# EAGLE design Controller V0.1 (EAGLE 9.5.1)
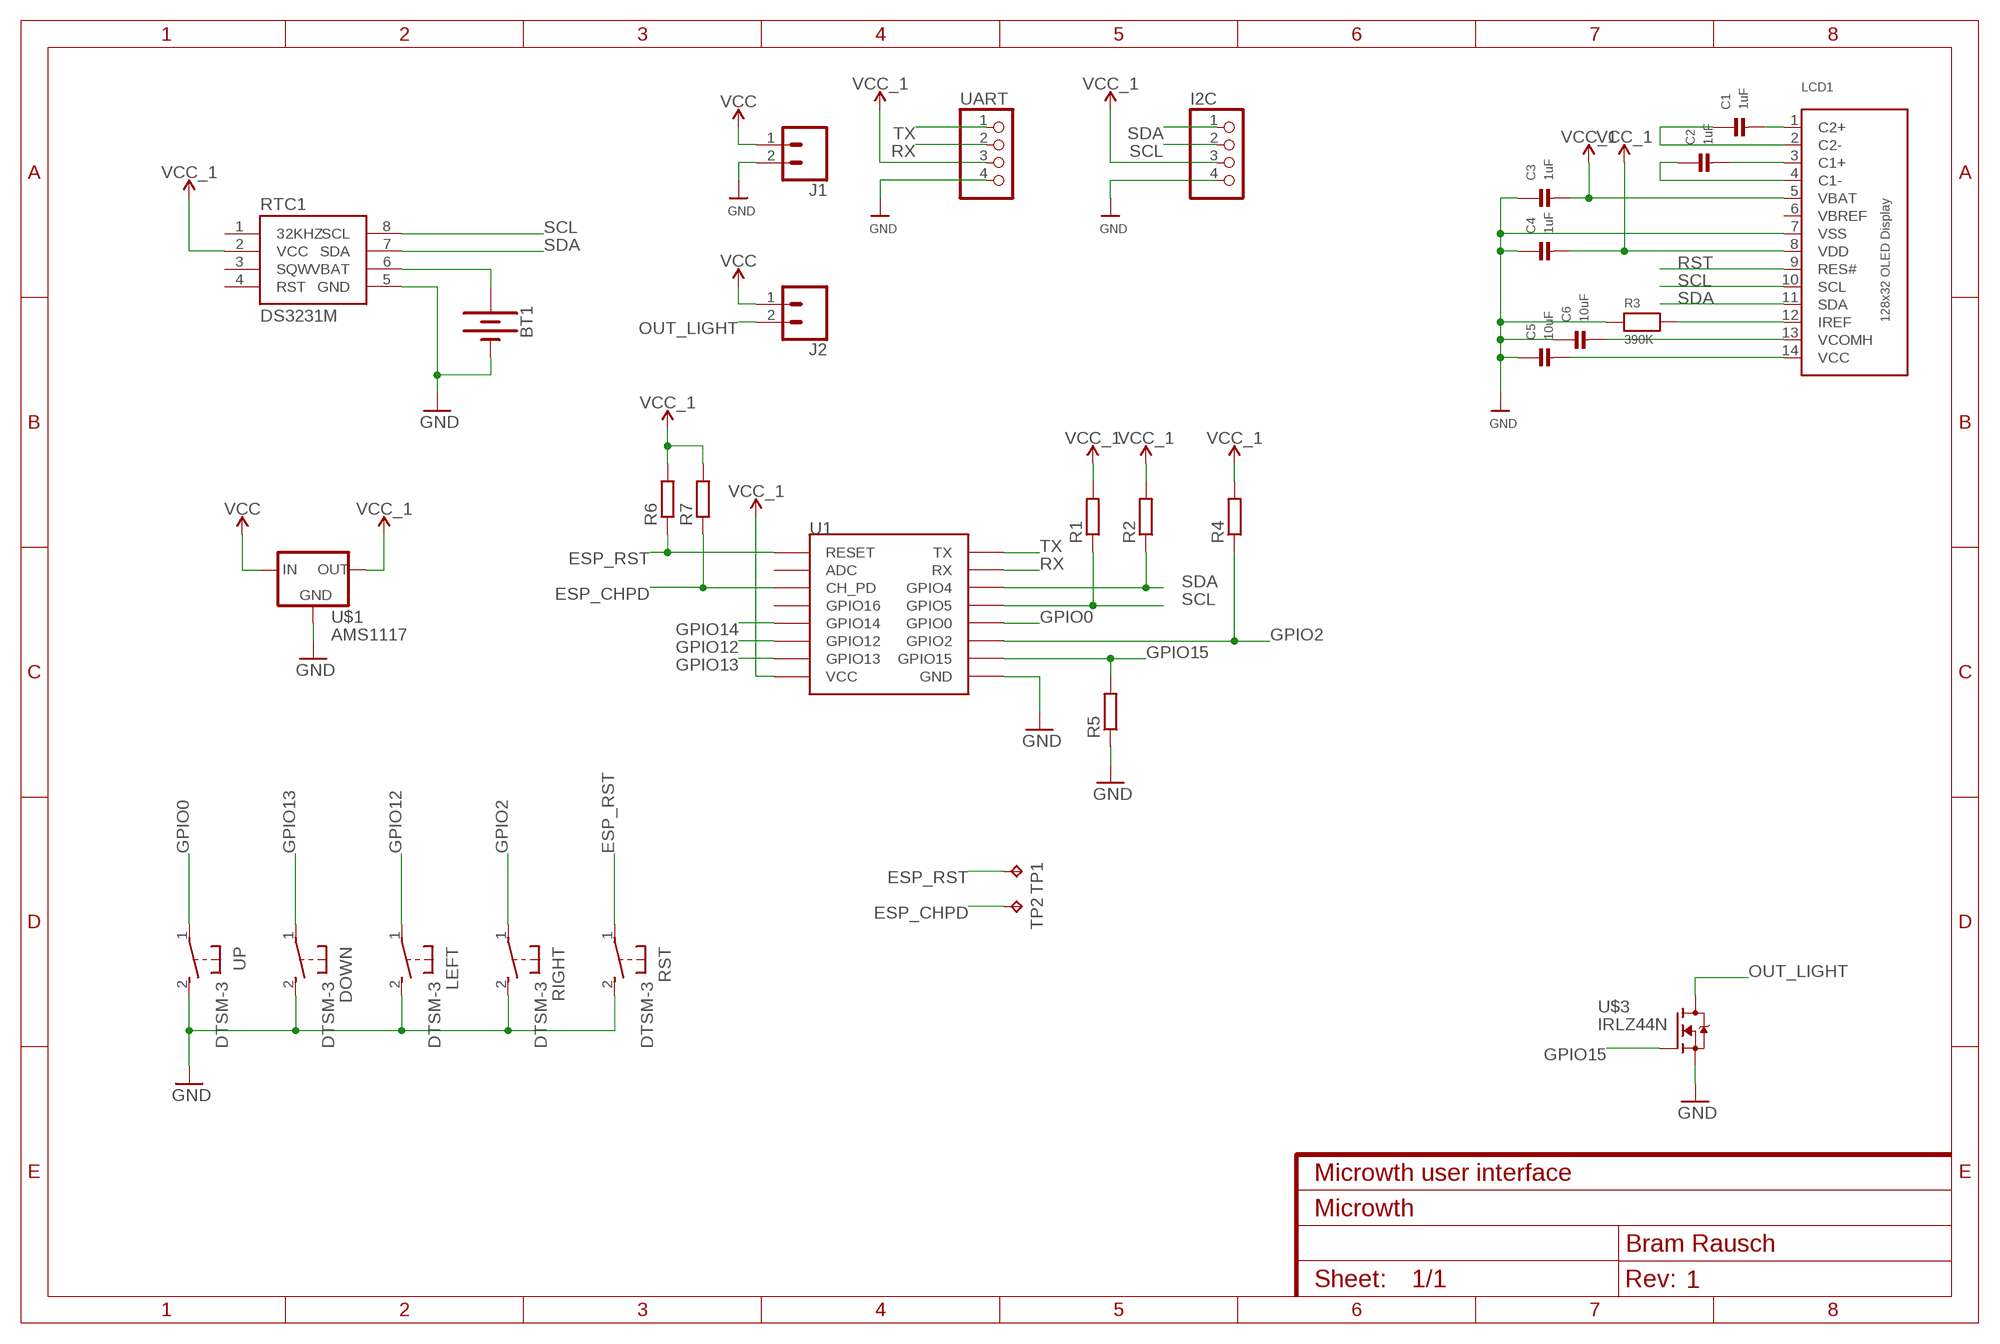
[diagram p0: schematic, sheet 1]
FRAME1 (FRAME-A4L): PROJECT: Microwth; TITLE: Microwth user interface

## Parts
BT1  BATTERY-20MM_PTH  [BATTCOM_20MM_PTH]
C1  1uF  CAP_CERAMIC0805  [0805]
C2  1uF  CAP_CERAMIC0805  [0805]
C3  1uF  CAP_CERAMIC0805  [0805]
C4  1uF  CAP_CERAMIC0805  [0805]
C5  10uF  CAP_CERAMIC0805  [0805]
C6  10uF  CAP_CERAMIC0805  [0805]
DOWN  DTSM-3  [DTSM-3]
I2C  PINHD-1X4  [1X04]
J1  CONN_02PTH4  [1X02_XTRA_BIG]
J2  CONN_02PTH4  [1X02_XTRA_BIG]
LCD1  DISP_OLED_UG-2832HSWEG02  [UG-2832HSWEG02_WRAPUNDER]
LEFT  DTSM-3  [DTSM-3]
R1  R-EU_R0805  [R0805]
R2  R-EU_R0805  [R0805]
R3  390K  RESISTOR0805  [0805]
R4  R-EU_R0805  [R0805]
R5  R-EU_R0805  [R0805]
R6  R-EU_R0805  [R0805]
R7  R-EU_R0805  [R0805]
RIGHT  DTSM-3  [DTSM-3]
RST  DTSM-3  [DTSM-3]
RTC1  DS3231M  [SO08]
TP1  TPB2,54  [B2,54]
TP2  TPB2,54  [B2,54]
U1  ESP12SMD  [ESP12-SMD]
U$1  AMS1117  [SOT223]
U$3  IRLZ44N  [TO220]
UART  PINHD-1X4  [1X04]
UP  DTSM-3  [DTSM-3]

## Nets
ESP_CHPD: R7.1 TP2.TP U1.CH_PD
ESP_RST: R6.1 RST.1 TP1.TP U1.RESET
GND: BT1.2(-) C3.1 C4.1 C5.1 C6.1 DOWN.2 I2C.4 J1.2 LCD1.7(VSS) LEFT.2 R3.1 R5.1 RIGHT.2 RST.2 RTC1.5(GND) U1.GND U$1.1(GND) U$3.3(S) UART.4 UP.2
GPIO0: U1.GPIO0 UP.1
GPIO2: R4.1 RIGHT.1 U1.GPIO2
GPIO12: LEFT.1 U1.GPIO12
GPIO13: DOWN.1 U1.GPIO13
GPIO14: U1.GPIO14
GPIO15: R5.2 U1.GPIO15 U$3.1(G)
N$1: C1.2 LCD1.1(C2+)
N$2: C1.1 LCD1.2(C2-)
N$3: C2.2 LCD1.3(C1+)
N$4: C2.1 LCD1.4(C1-)
N$5: C6.2 LCD1.13(VCOMH)
N$6: C5.2 LCD1.14(VCC)
N$7: LCD1.12(IREF) R3.2
N$8: BT1.1(+) RTC1.6(VBAT)
OUT_LIGHT: J2.2 U$3.2(D)
RST: LCD1.9(RES#)
RX: U1.RXD0(RX) UART.2
SCL: I2C.2 LCD1.10(SCL) R1.1 RTC1.8(SCL) U1.GPIO5
SDA: I2C.1 LCD1.11(SDA) R2.1 RTC1.7(SDA) U1.GPIO4
TX: U1.TXD0(TX) UART.1
VCC: J1.1 J2.1 U$1.3(IN)
VCC_1: C3.2 C4.2 I2C.3 LCD1.5(VBAT) LCD1.8(VDD) R1.2 R2.2 R4.2 R6.2 R7.2 RTC1.2(VCC) U1.VCC U$1.2(OUT) UART.3
Unconnected: RTC1.1(32KHZ) RTC1.3(SQW) RTC1.4(RST) U1.ADC U1.GPIO16

## Power pins joined to a net without a drawn wire
VBREF: LCD1.6(VBREF)

## Library data of the parts
BT1 = SparkFun-Batteries:BATTERY: Battery - Single Cell A variety of battery chemistries, sizes, and footprints. Device List: 20MM_PTH - Coin Cell Battery Holder - 20mm (PTH) <https://www.sparkfun.com/products/783> 12MM_SMD - Coin Cell Battery Holder - 12mm (SMD) <https://www.sparkfun.com/products/10592> 12MM_PTH - Coin Cell Battery Holder - 12mm (PTH) <https://www.sparkfun.com/products/7948> 20MM_SMD - 20mm Coin Cell Battery Holder (SMD) (2 legs) Used on the Big Time Watch Kit <https://www.sparkfun.com/products/11734> 20MM_SMD_4LEGS - Coin Cell Battery Holder - 20mm (SMD) <https://www.sparkfun.com/products/11892> 20MM_SMD_4LEGS_OVERPASTE - Coin Cell Battery Holder - 20mm (SMD) <https://www.sparkfun.com/products/11892> (Over-paste on the legs) 24.5MM_PTH - Coin Cell Battery Holder - 24.5mm (PTH) <https://www.sparkfun.com/products/8863> 9V - 9V Battery Holder - PC Mount Used on the SparkFun SparkPunk Sound Kit <https://www.sparkfun.com/products/11177> and SparkFun SparkPunk Sequencer Kit <https://www.sparkfun.com/products/12707> 18650 - Battery Holder - 18650 (PTH) <https://www.sparkfun.com/products/13113> AA - Battery Holder - 1xAA (PTH) <https://www.sparkfun.com/products/7949> AAA - Battery Holder - 1xAAA (PTH) <https://www.sparkfun.com/products/12718> AA_KIT - Battery Holder - 1xAA (PTH) <https://www.sparkfun.com/products/7949> Special kit package - pads only have exposed copper on one side of the board. AAA_KIT - Battery Holder - 1xAAA (PTH) <https://www.sparkfun.com/products/12718> Special kit package - pads only have exposed copper on one side of the board.; PROD_ID: BATT-09031; SF_SKU: PRT-00783
C1-C6 = microbuilder:CAP_CERAMIC: Ceramic Capacitors 0402 - 0402 Surface Mount Capacitors 16pF 50V 5% [Digikey: 445-4899-2-ND] 18pF 50V 5% [Digikey: 490-1281-2-ND] 22pF 50V 5% [Digikey: 490-1283-2-ND] 68pF 50V 5% [Digikey: 490-1289-2-ND] 0.1uF 10V 10% [Digikey: 490-1318-2-ND] 1.0uF 6.3V 10% [Digikey: 490-1320-2-ND] 0603 - 0603 Surface Mount Capacitors 16 pF 50V 5% [Digikey: 445-5051-2-ND] 22 pF 50V [Digikey: PCC220ACVTR-ND] 33 pF 50V 5% [Digikey: 490-1415-1-ND] 56pF 50V 5% [Digikey: 490-1421-1-ND] 220pF 50V 5% [Digikey: 445-1285-1-ND] 680 pF 50V 2200 pF 50V 5% C0G [Digikey: 445-1297-1-ND] 5600 pF 100V 5% X7R [Digikey: 478-3711-1-ND] 0.1 µF 25V 10% [Digikey: PCC2277TR-ND] 0.22 µF 16V 10% X7R [Digikey: 445-1318-1-ND] 1.0 µF 25V 10% [Digikey: 445-5146-2-ND] 0603 - RF Specific 3pF 250V +/-0.1pF RF [Digikey: 712-1347-1-ND] 18 pF 250V 5% [Digikey: 478-3505-1-ND or 712-1322-1-ND] 56 pF 250V 5% C0G RF [Digikey: 490-4867-1-ND] 68 pF 250V RF [Digikey: 490-4868-1-ND] 0805 - 0805 Surface Mount Capacitors 220 pF 250V 2% RF Ceramic Capacitor [Digikey: 712-1398-1-ND] 1000 pF 50V 2% NP0 Ceramic Capacitor [Digikey: 478-3760-1-ND] 0.1 µF 25V 10% Ceramic Capacitor [Digikey: PCC1828TR-ND] 1.0 µF 16V 10% Ceramic Capacitor[Digikey: 490-1691-2-ND] 10.0 µF 10V 10% Ceramic Capacitor[Digikey: 709-1228-1-ND] 10.0 uF 16V 10% Ceramic Capacitor [Digikey: 478-5165-2-ND] 47 uF 6.3V 20% Ceramic Capacitor [Digikey: 587-1779-1-ND or 399-5506-1-ND] 1206 - 1206 Surface Mount Capacitors 47uF 10V 20% Ceramic Capacitor [Digikey: 490-5528-1-ND or 399-5508-1-ND or 445-6010-1-ND] 100uF 6.3V -20%, +80% Y5V Ceramic Capacitor (Digikey: 490-4512-1-ND, Mouser: 81-GRM31CF50J107ZE1L)
DOWN LEFT RIGHT RST UP = switch-tact:DTSM-3
I2C UART = pinhead:PINHD-1X4: PIN HEADER
J1 J2 = SparkFun-Connectors:CONN_02: Multi connection point. Often used as Generic Header-pin footprint for 0.1 inch spaced/style header connections On any of the 0.1 inch spaced packages, you can populate with these: Break Away Headers - Straight <https://www.sparkfun.com/products/116> (PRT-00116) Break Away Male Headers - Right Angle <https://www.sparkfun.com/products/553> (PRT-00553) Female Headers <https://www.sparkfun.com/products/115> (PRT-00115) Break Away Headers - Machine Pin <https://www.sparkfun.com/products/117> (PRT-00117) Break Away Female Headers - Swiss Machine Pin <https://www.sparkfun.com/products/743> (PRT-00743) For SCREWTERMINALS and SPRING TERMINALS visit here: Screw Terimnals on SparkFun.com <https://www.sparkfun.com/search/results?term=Screw+Terminals> (5mm/3.5mm/2.54mm spacing) This device is also useful as a general connection point to wire up your design to another part of your project. Our various solder wires solder well into these plated through hole pads. Hook-Up Wire - Assortment (Stranded, 22 AWG) <https://www.sparkfun.com/products/11375> (PRT-11375) Hook-Up Wire - Assortment (Solid Core, 22 AWG) <https://www.sparkfun.com/products/11367> (PRT-11367) View the entire wire category on our website here <https://www.sparkfun.com/categories/141> Special notes: Molex polarized connector foot print use with: PRT-08233 with associated crimp pins and housings. 2.54_SCREWTERM for use with PRT-10571. 3.5mm Screw Terminal footprints for PRT-08084 5mm Screw Terminal footprints for use with PRT-08432
LCD1 = microbuilder:DISP_OLED_UG-2832HSWEG02: 128x32 I2C 0.91" Monochrome OLED Display
R1 R2 R4-R7 = rcl:R-EU_: RESISTOR, European symbol; SPICEPREFIX: R
R3 = microbuilder:RESISTOR: Resistors 0402 - 0402 Surface Mount Package 22 Ohm 1% 1/16W [Digikey: 311-22.0LRTR-ND] 33 Ohm 5% 1/16W 1.0K 5% 1/16W 1.5K 5% 1/16W 2.0K 1% 1/16W 10.0K 1% 1/16W [Digikey: 311-10.0KLRTR-ND] 10.0K 5% 1/16W [Digikey: RMCF0402JT10K0TR-ND] 12.1K 1% 1/16W [Digikey: 311-22.0LRTR-ND] 100.0K 5% 1/16W 0603 - 0603 Surface Mount Package 0 Ohm 1/10 Watt 1% Resistor 15 Ohm 1/10 Watt 1% Resistor 33 Ohm 1/10 Watt 1% Resistor 49.9 Ohm 1/10 Watt 1% Resistor 100 Ohm 1/10 Watt 1% Resistor 150 Ohm 1/10 Watt 1% Resistor 240 Ohm 1/10 Watt 1% Resistor 390 Ohm 1/10 Watt 1% Resistor 560 Ohm 1/10 Watt 1% Resistor 680 Ohm 1/10 Watt 1% Resistor 750 Ohm 1/10 Watt 1% Resistor 1.0K Ohm 1/10 Watt 1% Resistor 1.5K Ohm 1/10 Watt 1% Resistor 2.0K Ohm 1/10 Watt 1% Resistor 2.2K Ohm 1/10 Watt 1% Resistor 3.3K Ohm 1/10 Watt 1% Resistor 4.7K Ohm 1/10 Watt 1% Resistor 10.0K Ohm 1/10 Watt 1% Resistor 12.0K Ohm 1/10 Watt 1% Resistor 12.1K Ohm 1/10 Watt 1% Resistor 20.0K Ohm 1/10 Watt 1% Resistor 33.0K Ohm 1/10 Watt 1% Resistor 100.0K Ohm 1/10 Watt 1% Resistor 0805 - 0805 Surface Mount Package 0 Ohm 1/8 Watt 1% Resistor 33 Ohm 1/8 Watt 1% Resistor 100 Ohm 1/8 Watt 1% Resistor 150 Ohm 1/8 Watt 1% Resistor 200 Ohm 1/8 Watt 1% Resistor 240 Ohm 1/8 Watt 1% Resistor 330 Ohm 1/8 Watt 1% Resistor 390 Ohm 1/8 Watt 1% Resistor 470 Ohm 1/8 Watt 1% Resistor 1.0K Ohm 1/8 Watt 1% Resistor 1.5K Ohm 1/8 Watt 1% Resistor 2.0K Ohm 1/8 Watt 1% Resistor 4.7K Ohm 1/8 Watt 1% Resistor 5.1K Ohm 1/8 Watt 1% Resistor 5.6K Ohm 1/8 Watt 1% Resistor 10.0K Ohm 1/8 Watt 1% Resistor 22.0K Ohm 1/8 Watt 1% Resistor 33.0K Ohm 1/8 Watt 1% Resistor 100K Ohm 1/8 Watt 1% Resistor 1206 - 1206 Surface Mount Package 2012 - 2010 Surface Mount Package 0.11 Ohm 1/2 Watt 1% Resistor - Digikey: RHM.11UCT-ND
RTC1 = SparkFun-Clocks:DS3231M: DS3231M Real Time Clock Accuracy +/-5ppm. Battery Backup. 2.3V to 5.5V. Datasheet <https://cdn.sparkfun.com/datasheets/Dev/Beagle/DS3231M.pdf> SparkFun Products CryptoCape <https://www.sparkfun.com/products/12773> (DEV-12773) SparkFun CryptoShield <https://www.sparkfun.com/products/13183> (DEV-13183); PROD_ID: IC-11985
TP1 TP2 = testpad:TP: Test pad
U1 = esp8266modules:ESP12: ESP8266 Wifi module 12
U$1 = SparkFun-IC-Power:AMS1117
U$3 = transistor-fet:IRLZ44N

## Board
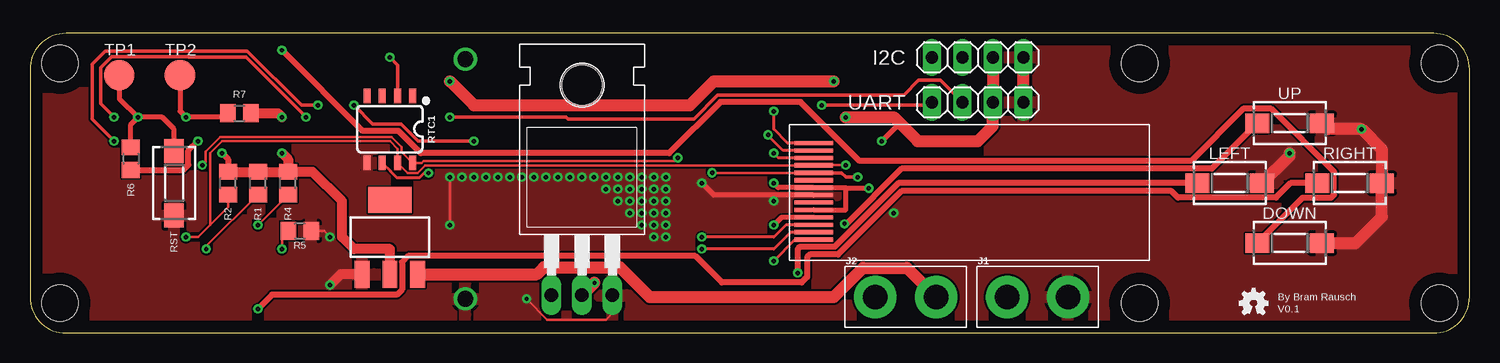
[diagram p1: board, top side]
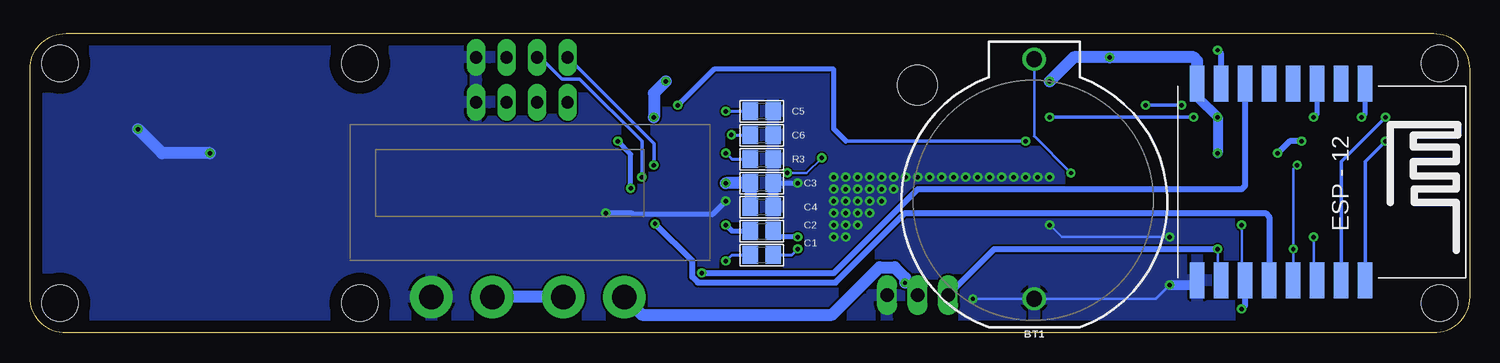
[diagram p2: board, bottom side, seen from below]

Size 120 x 25 mm. Coordinates in mm from the lower left corner, seen from the top.
Outline: 0,22 0,3 arc90 3,0 117,0 arc90 120,3 120,22 arc90 117,25 3,25 arc90 0,22
Copper layers (1*16): Top 0.035mm / dielectric 1.5mm / Bottom 0.035mm
Design rules "default": minimum track width 6mil, minimum drill 0.35mm, track to track 6mil, track to pad 6mil, pad to pad 6mil, via to via 6mil, smd to smd 6mil, copper to edge 40mil, drill to drill 6mil, minimum pad ring 10mil, minimum via ring 8mil, stop-mask expansion 4mil, vias tented up to drill 0mil, thermal gap 10mil
Holes 3 mm at 2.5,22.5 2.5,2.5 117.5,22.5 117.5,2.5 92.5,22.5 92.5,2.5

### Footprints (pad centres in the part's own frame; a part is rotated, then mirrored left to right if it is on the bottom)
BATTCOM_20MM_PTH = drill 1.3: 1 11.85,0; 2 -8.15,0
0805 = smd 1.3 x 1.5: 1 -0.95,0; 2 0.95,0
DTSM-3 = smd 2 x 1.6: 1 -2.7,0; 2 2.7,0
1X04 = drill 1.016 long: 1 -3.81,0; 2 -1.27,0; 3 1.27,0; 4 3.81,0
1X02_XTRA_BIG = drill 2.057 pad 3.556: 1 -2.54,0; 2 2.54,0
UG-2832HSWEG02_WRAPUNDER = smd 3.2 x 0.35 bottom: 1 14.678,-4.713; 2 14.678,-4.093; 3 14.678,-3.473; 4 14.678,-2.853; 5 14.678,-2.233; 6 14.678,-1.613; 7 14.678,-0.993; 8 14.678,-0.373; 9 14.678,0.247; 10 14.678,0.867; 11 14.678,1.487; 12 14.678,2.107; 13 14.678,2.727; 14 14.678,3.347
R0805 = smd 1.3 x 1.5: 1 -0.95,0; 2 0.95,0
SO08 = smd 0.6 x 1.2: 1 -1.905,-2.8; 2 -0.635,-2.8; 3 0.635,-2.8; 4 1.905,-2.8; 5 1.905,2.8; 6 0.635,2.8; 7 -0.635,2.8; 8 -1.905,2.8
B2,54 = smd 2.54 x 2.54: TP 0,0
ESP12-SMD = smd 3 x 1.2: ADC -8.3,3.8; CH_PD -8.3,1.8; GND 8.1,-8.2; GPIO0 8.1,-2.2; GPIO2 8.1,-4.2; GPIO4 8.1,1.8; GPIO5 8.1,-0.2; GPIO12 -8.3,-4.2; GPIO13 -8.3,-6.2; GPIO14 -8.3,-2.2; GPIO15 8.1,-6.2; GPIO16 -8.3,-0.2; RESET -8.3,5.8; RXD0 8.1,3.8; TXD0 8.1,5.8; VCC -8.3,-8.2
SOT223 = smd 1.219 x 2.235: 1 -2.311,-3.099; 2 0,-3.099; 3 2.311,-3.099 | smd 3.6 x 2.2: 4 0,3.099
TO220 = drill 1.118 long: 1 -2.54,-6.35; 2 0,-6.35; 3 2.54,-6.35 | hole 3.302: 0,11.176

### Placement (x,y rotation side)
BT1  36.28,11 90 bottom
C1  59,6.5 180 bottom
C2  59,8.5 0 bottom
C3  59,12.5 180 bottom
C4  59,10.5 180 bottom
C5  59,18.5 180 bottom
C6  59,16.5 180 bottom
DOWN  105,7.5 0 top
I2C  79,23 0 top
J1  84,3 0 top
J2  73,3 180 top
LCD1  80,12.5 0 bottom
LEFT  100,12.5 0 top
R1  19,12.5 90 top
R2  16.5,12.5 90 top
R3  59,14.5 180 bottom
R4  21.5,12.5 90 top
R5  22.5,8.5 180 top
R6  8.41,14.55 270 top
R7  17.45,18.33 0 top
RIGHT  110,12.5 0 top
RST  12,12.5 270 top
RTC1  30,17 180 top
TP1  7.45,21.5 0 top
TP2  12.5,21.5 0 top
U1  14.5,12.5 270 bottom
U$1  30,8 0 top
U$3  46.01,9.5 0 top
U$4  [OSHW-LOGO-MINI]  102,2.5 0 top
UART  79,19.25 0 top
UP  105,17.5 0 top

### Tracks (layer width: path | path; a pad name or v marks a point on that pad's centre or on a via)
ESP_CHPD  (via drill 0.35)
  Top 0.203: R7.1 16.17,18
  Top 0.406: 16.17,18 v13,18 12.5,18.5 TP2.TP
  Bottom 0.203: U1.CH_PD 13,20.5
  Bottom 0.406: v13,18 12.7,18.3 U1.CH_PD
ESP_RST  (via drill 0.35)
  Top 0.406: RST.1 12,17 11,18 v9,18 | TP1.TP 7.45,19.55 v9,18 | R6.1 8.41,17.41 v9,18
  Bottom 0.406: v9,18 8.7,18.3 U1.RESET
GND  (via drill 0.35)
  Top 0.203: R5.1 24.5,8.5 v25,8 | v35,9 v35,13 | v41.39,2.85 43.12,1.12 48,1.12 48.55,1.67 U$3.3
  Top 0.406: LCD1.7 62,11.51 | 62,11.51 57,11.51 57,11.5 v56,12.5 | 62,11.51 v62,11
  Top 0.813: U$1.1 25.9,4.9 v25,4
  Top 1.016: UART.4 I2C.4 | LEFT.2 105,14.8 v105,15 | UP.2 108.2,17 v111,17 112.7,15.3 RIGHT.2 112.7,9.7 110.5,7.5 DOWN.2
  Bottom 0.203: v25,8 34,8 v35,9 | v41.39,2.85 BT1.2 26.15,2.85
  Bottom 0.254: 26.15,2.85 26,3 v25,4
  Bottom 0.406: C3.1 v56,12.5 | v72,10 69.81,10 69.69,9.88 63.12,9.88 v62,11
  Bottom 0.813: v25,4 23.1,4 U1.GND | C3.1 C4.1
  Bottom 1.016: v105,15 109,15 v111,17
  other vias: 36,13 37,13 38,13 39,13 40,13 41,13 42,13 43,13 44,13 45,13 46,13 47,13 48,13 49,13 50,13 51,13 52,13 53,13 48,12 49,12 50,12 51,12 52,12 49,11 50,11 50,10 51,10 51,9 52,9 52,8 53,8 53,9 53,10 52,10 51,11 52,11 53,11 53,12
  pour Top: 0,0 0,26 120,26 121,25 121,0 120,-1 1,-1
  pour Bottom: -2,-2 -3,-1 -3,27 -2,28 123,28 123,-1 121,-3 -1,-3
GPIO0  (via drill 0.35)
  Top 0.508: UP.1 98.51,13.71 72.66,13.71 68.06,9.11 v67.89,9.11
  Bottom 0.508: U1.GPIO0 16.7,9.7 17,10 47.07,10 52.85,4.21 64.33,4.21 64.78,4.67 64.78,6.01 v67.89,9.11
GPIO2  (via drill 0.35)
  Top 0.203: R4.1 21.5,11.5 v19,9
  Top 0.508: RIGHT.1 105.08,12.5 103.87,11.29 95.71,11.29 95.16,11.84 72.66,11.84 67.36,6.54 65,6.54 64.78,6.33 64.78,4.67 64.33,4.21 57.67,4.21 55.47,6.42 31.53,6.42 31.02,5.91 31.02,3.62 30.59,3.19 20.19,3.19 v19,2
  Bottom 0.203: v19,9 19,4.7 U1.GPIO2
  Bottom 0.508: v19,2 18.7,2.3 U1.GPIO2
GPIO12  (via drill 0.35)
  Top 0.508: LEFT.1 72.39,12.5 67.09,7.21 64.21,7.21 64,7 v64,5
  Bottom 0.508: v64,5 53,5 46,12 19,12 18.7,12.3 U1.GPIO12
GPIO13  (via drill 0.35)
  Top 0.508: DOWN.1 106.09,11.29 108.47,11.29 108.71,11.53 108.71,13.47 103.47,18.71 101.13,18.71 96.79,14.37 69.15,14.37 64.23,19.29 57.56,19.29 53.27,15 32.58,15 30.72,16.86 27.74,16.86 v21,23.61
  Bottom 0.508: U1.GPIO13 20.7,23.31 v21,23.61
GPIO15  (via drill 0.35)
  Top 0.203: R5.2 21,7.95 v21,7
  Bottom 0.203: v21,7 21,4.7 U1.GPIO15
  Bottom 0.508: U$3.1 39.62,7 v21,7
N$1  (via drill 0.35)
  Top 0.254: v62,6 63.79,7.79 LCD1.1
  Bottom 0.254: v62,6 61.5,6.5 C1.2
N$2  (via drill 0.35)
  Top 0.254: LCD1.2 63.41,8.41 62,7 v56,7
  Bottom 0.254: v56,7 56.5,6.5 C1.1
N$3  (via drill 0.35)
  Top 0.254: LCD1.3 65.3,9 63,9 62,8 v56,8
  Bottom 0.406: v56,8 57.55,8 C2.2
N$4  (via drill 0.35)
  Top 0.406: LCD1.4 62.65,9.65 v62,9
  Bottom 0.406: v62,9 61.5,8.5 C2.1
N$5  (via drill 0.35)
  Top 0.254: LCD1.13 62.77,15.23 61.53,16.46 v61.53,16.54
  Bottom 0.254: v61.53,16.54 59.98,16.54 C6.2
N$6  (via drill 0.35)
  Top 0.254: LCD1.14 63.15,15.85 62,17 v62,18.5
  Bottom 0.254: v62,18.5 C5.2
N$7  (via drill 0.35)
  Top 0.254: LCD1.12 62.39,14.61 v62,15
  Bottom 0.254: v62,15 61.5,14.5 R3.2
N$8  (via drill 0.35)
  Top 0.254: RTC1.6 30.06,13.51 30.06,13.48 30.57,12.96 32.47,12.96 32.86,13.36 v33.21,13.36
  Bottom 0.203: 36.28,16.42 BT1.1
  Bottom 0.254: v33.21,13.36 36.28,16.42
OUT_LIGHT  (via drill 0.35)
  Top 1.016: v47.05,4.19 U$3.2
  Bottom 1.016: v47.05,4.19 47.05,4.61 47.93,5.49 49.17,5.49 53.13,1.52 68.98,1.52 J2.2
RX  (via drill 0.35)
  Top 0.305: v23,18 18,23 13.23,23 13.15,23.07 6.8,23.07 5.88,22.15 5.88,19.12 v7,18 | v35,18 44.7,18 44.84,17.86 55.34,17.86 57.32,19.84 72.84,19.84 74.08,21.08 75.9,21.08 UART.2
  Bottom 0.305: U1.RXD0 10.7,14.3 v7,18 | v23,18 v35,18
SCL  (via drill 0.35)
  Top 0.203: v14.37,14 14.64,14.28 14.64,15.15 15.85,16.36 30.15,16.36 30.99,15.51 30.99,15.11 RTC1.8 32.66,14.2 32.8,14.34 53.72,14.34 v54,14.62 | R1.1 14.7,7.25 v14.7,7 | v56.87,13.37 LCD1.10
  Top 0.305: LCD1.10 67.63,13.37 68,13 v69,13
  Bottom 0.203: v14.37,14 14.7,13.67 v14.7,7 U1.GPIO5 | v54,14.62 55.25,13.37 v56.87,13.37
  Bottom 0.305: I2C.2 77.46,23 75.63,21.17 74.17,21.17 69,16 v69,13
SDA  (via drill 0.35)
  Top 0.203: 15,9 15,15 16,16 30,16 30.64,15.37 RTC1.7 31.49,13.35 32.31,13.35 32.95,13.99 LCD1.11 | 15,9 14,8 v13,8 | R2.1 16.5,10.5 15,9 | 65.33,14 v68,14
  Top 0.254: LCD1.11 65.33,14
  Top 0.305: v68,14 67.99,13.99
  Bottom 0.203: v13,8 13,4.7 U1.GPIO4
  Bottom 0.305: I2C.1 68,15.81 v68,14
TX  (via drill 0.35)
  Top 0.305: UART.1 74.94,19 v66,19 | v37,16 32.37,16 30.95,17.42 28.58,17.42 v27,19 | v24,19 22.65,19 18.11,23.53 6.28,23.53 5.17,22.42 5.17,17.83 v7,16
  Bottom 0.305: v37,16 52,16 | v27,19 v24,19 | v7,16 8.7,14.3 U1.TXD0
  Bottom 0.406: 52,16 53,17 53,22 63,22 v66,19
VCC
  Top 1.016: U$1.3 42.26,4.9 42.85,5.49 49.17,5.49 51.66,3 67.01,3 69.45,5.44 73.1,5.44 J2.1
  Bottom 1.016: J2.1 J1.1
VCC_1  (via drill 0.35)
  Top 0.305: v30,23 30.64,22.36 RTC1.2
  Top 0.406: v62,12.5 62.37,12.13 LCD1.8 68,12.13 | 68,12.13 68,10.27 LCD1.5 | 68,12.13 68.05,12.08 v69.92,12.08 | v71,16 72.5,17.5
  Top 0.508: v14,16 13.21,15.21 13.21,14.03 12.78,13.6 R6.2 | v16,15 16.5,14.5 R2.2
  Top 0.813: R2.2 R1.2 R4.2 | R7.2 20.67,18.33 v21,18 | v21,15 21.5,14.5 R4.2 | U$1.2 30,7 27,7 26,8 26,11 23.55,13.45 R4.2
  Top 1.016: I2C.3 UART.3 80.27,17.27 79,16 74,16 72.5,17.5 72,18 v68,18 | v35,21 37,19 55,19 57,21 v67,21
  Bottom 0.406: v69.92,12.08 69.92,14.92 v71,16
  Bottom 0.508: v14,16 15,16 v16,15
  Bottom 0.813: v21,15 v21,18 22.7,19.7 U1.VCC
  Bottom 1.016: U1.VCC 22.7,22.7 23,23 v30,23 33,23 v35,21 | v67,21 68,20 v68,18 | C4.2 C3.2 v62,12.5

### Text on the board
tNames: By Bram Rausch | V0.1